# Altium project 113b_Buck_MN.PrjPcb
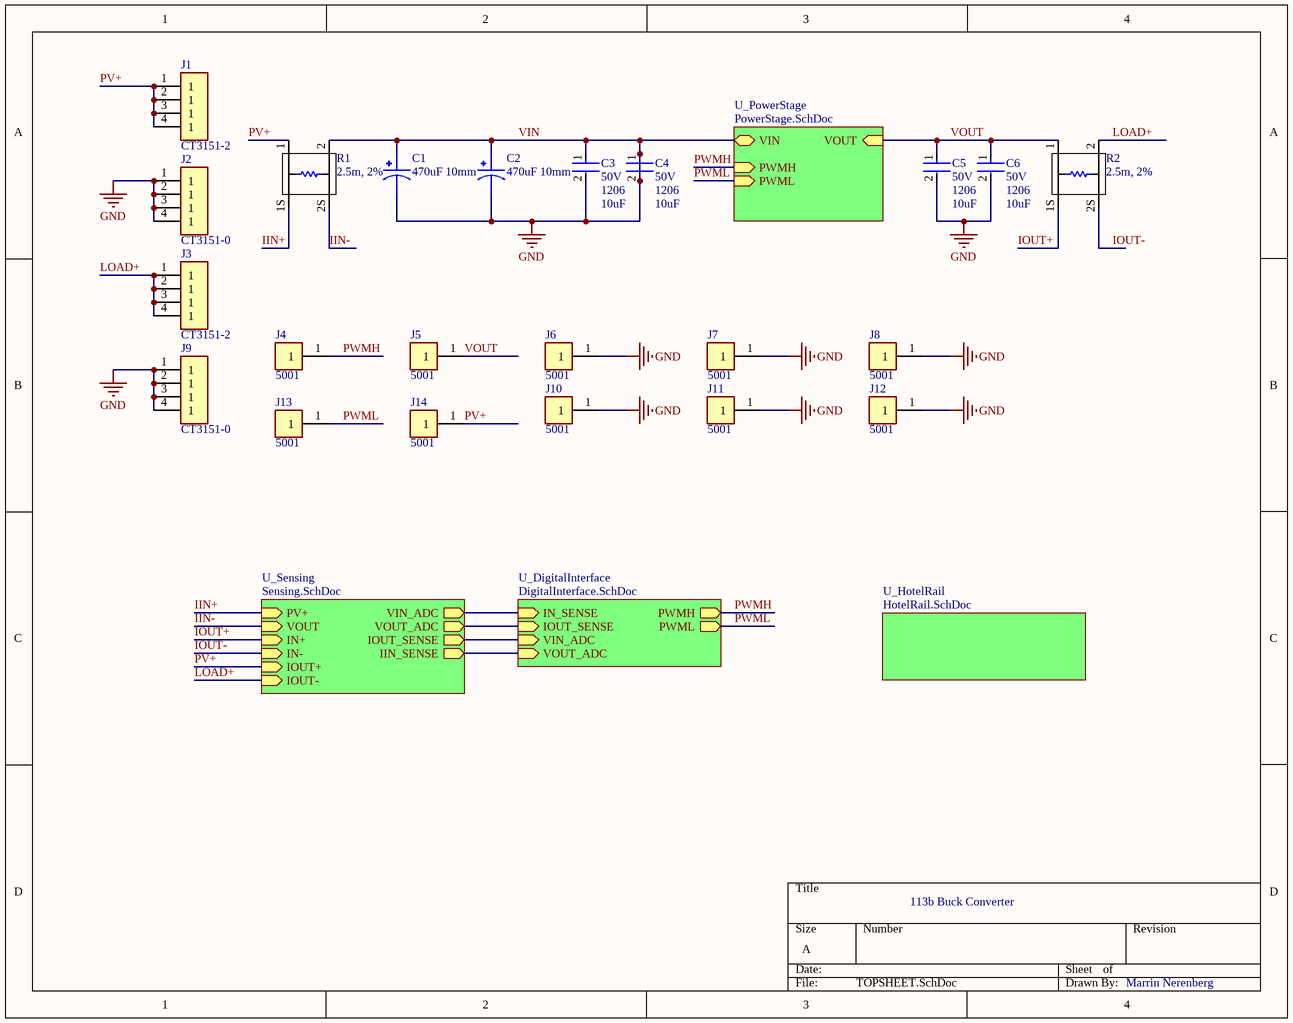
[diagram p0: TOPSHEET.SchDoc]
5 sheets, 95 parts. Net scope: hierarchical (ports join the sheet entries above them; power ports are global).
Board file: MN_BUCK113b_PCB.PcbDoc
Sheets:
  TOPSHEET.SchDoc
    U_HotelRail = HotelRail.SchDoc
    U_DigitalInterface = DigitalInterface.SchDoc
    U_Sensing = Sensing.SchDoc
    U_PowerStage = PowerStage.SchDoc

## Sheet TOPSHEET.SchDoc
size A; SheetNumber: 1; SheetTotal: 5

### Parts
C1  470uF 10mm  [CAPPRD500W60D1000H2200]
C2  470uF 10mm  [CAPPRD500W60D1000H2200]
C3  Voltage Rating (DC): 50V  Case/Package: 1206  Capacitance: 10uF  [FP-1206-L_3_2_0_2-W_1_6_0-IPC_B]  (hidden comment: 12065C475KAT2A)
C4  Voltage Rating (DC): 50V  Case/Package: 1206  Capacitance: 10uF  [FP-1206-L_3_2_0_2-W_1_6_0-IPC_B]  (hidden comment: 12065C475KAT2A)
C5  Voltage Rating (DC): 50V  Case/Package: 1206  Capacitance: 10uF  [FP-1206-L_3_2_0_2-W_1_6_0-IPC_B]  (hidden comment: 12065C475KAT2A)
C6  Voltage Rating (DC): 50V  Case/Package: 1206  Capacitance: 10uF  [FP-1206-L_3_2_0_2-W_1_6_0-IPC_B]  (hidden comment: 12065C475KAT2A)
J1  CT3151-2  [CALTEST_CT3151-2]
J2  CT3151-0  [CT3151-0]
J3  CT3151-2  [CALTEST_CT3151-2]
J4  5001  [FP-5001-MFG]
J5  5001  [FP-5001-MFG]
J6  5001  [FP-5001-MFG]
J7  5001  [FP-5001-MFG]
J8  5001  [FP-5001-MFG]
J9  CT3151-0  [CT3151-0]
J10  5001  [FP-5001-MFG]
J11  5001  [FP-5001-MFG]
J12  5001  [FP-5001-MFG]
J13  5001  [FP-5001-MFG]
J14  5001  [FP-5001-MFG]
R1  2.5m, 2%  [OHMITE_FC4L32]
R2  2.5m, 2%  [OHMITE_FC4L32]

### Sub-sheets
U_DigitalInterface = DigitalInterface.SchDoc: IN_SENSE (in), IOUT_SENSE (in), VIN_ADC (in), VOUT_ADC (in), PWMH (out), PWML (out)
U_HotelRail = HotelRail.SchDoc: no entries
U_PowerStage = PowerStage.SchDoc: VIN (bidir), PWMH (in), PWML (in), VOUT (in)
U_Sensing = Sensing.SchDoc: VIN_ADC (out), PV+ (in), VOUT (in), VOUT_ADC (out), IOUT_SENSE (out), IIN_SENSE (out), IN+ (in), IN- (in), IOUT+ (in), IOUT- (in)

### Nets
VIN: C1.1 C1.2 C2.1 C2.2 C3.1 C3.2 C4.1 C4.2 C5.2 C6.2 J2.1 J2.2(1) J2.3(1) J2.4(1) J6.1 J7.1 J8.1 J9.1 J9.2(1) J9.3(1) J9.4(1) J10.1 J11.1 J12.1 R1.2 ; sheet U_PowerStage/VIN  [also labelled GND]
IIN+: R1.1S ; sheet U_Sensing/PV+
IIN-: R1.2S ; sheet U_Sensing/VOUT
IN_SENSE: sheet U_DigitalInterface/IOUT_SENSE, sheet U_Sensing/VOUT_ADC
IOUT+: R2.1S ; sheet U_Sensing/IN+  [project net IN+]
IOUT-: R2.2S ; sheet U_Sensing/IN-  [project net IN-]
IOUT_SENSE: sheet U_DigitalInterface/IN_SENSE, sheet U_Sensing/VIN_ADC
LOAD+: J3.1 J3.2(1) J3.3(1) J3.4(1) R2.2 ; sheet U_Sensing/IOUT-  [project net IOUT-]
PV+: J1.1 J1.2(1) J1.3(1) J1.4(1) J14.1 R1.1 ; sheet U_Sensing/IOUT+  [project net IOUT+]
PWMH: J4.1 ; sheet U_DigitalInterface/PWMH, sheet U_PowerStage/PWMH
PWML: J13.1 ; sheet U_DigitalInterface/PWML, sheet U_PowerStage/PWML
VIN_ADC: sheet U_DigitalInterface/VIN_ADC, sheet U_Sensing/IOUT_SENSE
VOUT: C5.1 C6.1 J5.1 R2.1 ; sheet U_PowerStage/VOUT
VOUT_ADC: sheet U_DigitalInterface/VOUT_ADC, sheet U_Sensing/IIN_SENSE

### Notes on the sheet
- 113b Buck Converter
- Marrin Nerenberg

### Library data of the parts
C1 C2 = B41856C7477M000: MF: {'manufacturer': u'EPCOS'}; Package: None; Price: None; Value: *; MP: B41856C7477M000; Availability: Unavailable
C3-C6 = CMP-2000-07581-3: CAP CER 4.7UF 50V X7R 1206; Manufacturer: Kyocera AVX; Dissipation Factor: 2.5%; Tolerance: 10%; Mount: Surface Mount; Width: 1.6mm; Voltage Rating: 50V; Case Code (Imperial): 1206; Packaging: Tape and Reel; Min Operating Temperature: -55°C; Contact Plating: Tin; Radiation Hardening: No; Depth: 1.6mm; Series: -; Construction: Flat; Dielectric: X7R; Length: 3.2mm; Max Operating Temperature: 125°C; RoHS Compliant: Yes; Lead Free: Lead Free; Package Quantity: 1; Case Code (Metric): 3216; Termination: SMD/SMT; REACH SVHC: No SVHC; Thickness: 0.07inch; Manufacturer Part Number: 12065C475KAT2A
J1 J3 = CT3151-2_1: Banana Jack Connector Standard Banana Solder Red; MF: {'manufacturer': u'Cal Test'}; Package: None; Price: None; Value: *; MP: CT3151-2; Availability: Unavailable
J2 J9 = CT3151-2: Banana Jack Connector Standard Banana Solder Red; MF: {'manufacturer': u'Cal Test'}; Package: None; Price: None; Value: *; MP: CT3151-2; Availability: Unavailable
J4-J8 J10-J14 = CMP-2000-05181-2: PC TEST POINT MINIATURE BLACK; Manufacturer: Keystone Electronics; Body Material: Bronze; Plating: Silver; Inside Diameter: 1.27mm; Hole Diameter: 1.6mm; Number of Ports: 1; Outside Diameter: 2.54mm; Insulation: Insulated; Insulation Material: Nylon; Mount: Through Hole; RoHS Compliant: Yes; Series: THM; Height: 0.3inch; Termination: Through Hole; Material: Nylon; Packaging: Bulk; Contact Material: Bronze; REACH SVHC: No SVHC; Contact Plating: Silver; Orientation: Straight; Lead Free: Lead Free; Package Quantity: 100; Length: 7.62mm; Flammability Rating: UL94 V-0; Number of Contacts: 1; Diameter: 2.54mm; Housing Color: Black; Color: Black; Manufacturer Part Number: 5001
R1 R2 = FC4L32R002GER: 2m, 0612, 2%, 1W; ID: 79; Mfg: Ohmite; Voltage: 0.045V; Current: 45A; TempOperatingMax: 155; TempOperatingMin: -55; MfgPN: FC4L32R002GER; Value: 2.5m; Tolerance: 2%; Power: 1W; RoHS: True; SMD: True; Material: Metal Foil; Footprint: 0612; Supplier 1: Digi-Key; Supplier Part Number 1: FC4L32R002GER-ND

## Sheet HotelRail.SchDoc
size A; SheetNumber: 5; SheetTotal: 5
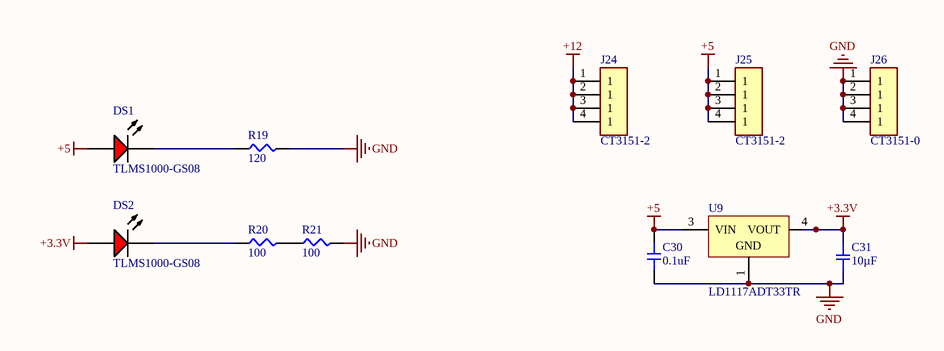
[diagram p1: HotelRail.SchDoc]

### Parts
C30  0.1uF
C31  10µF  [SMD-0603-RES]
DS1  TLMS1000-GS08  [VISH-TLMS1000_V]
DS2  TLMS1000-GS08  [VISH-TLMS1000_V]
J24  CT3151-2  [CALTEST_CT3151-2]
J25  CT3151-2  [CALTEST_CT3151-2]
J26  CT3151-0  [CT3151-0]
R19  120  [SMD-0603-RES]
R20  100  [SMD-0603-RES]
R21  100  [SMD-0603-RES]
U9  LD1117ADT33TR  [TO-252_L]

### Nets
+3.3V: C31.1 DS2.1(A) U9.4(VOUT)
+5: C30.2 DS1.1(A) J25.1 J25.2(1) J25.3(1) J25.4(1) U9.3(VIN)
+12: J24.1 J24.2(1) J24.3(1) J24.4(1)
GND: C30.1 C31.2 J26.1 J26.2(1) J26.3(1) J26.4(1) R19.2 R21.2 U9.1(GND)  [project net VIN]
NetDS1_2: DS1.2(K) R19.1
NetDS2_2: DS2.2(K) R20.1
NetR20_2: R20.2 R21.1

### Library data of the parts
C30 = C1608X7R1H104K080AA: 0.1uF, 0603, +/- 10%, 50V, X7R; Tolerance: +/- 10%; ID: 1; Mfg: TDK Corporation; TempOperatingMax: 125; TempOperatingMin: -55; TempStorageMax: 40; TempStorageMin: 5; Value: 0.1uF; MfgPN: C1608X7R1H104K080AA; Voltage: 50V; Material: X7R; RoHS: True; SMD: True; Footprint: 0603; Supplier 1: Digi-Key; Supplier Part Number 1: 445-1314-1-ND
C31 = GRM188R60J106ME47D: CAP CER 10UF 6.3V X5R 0603; Manufacturer: Murata Electronics North America; Factory Stock: 0; Unit Price (USD): 0.15; Minimum Quantity: 1; Tolerance: ±20%; Part Number: GRM188R60J106ME47D; Datasheets: http://www.murata.com/~/media/webrenewal/support/library/catalog/products/capacitor/mlcc/c02e.pdf; Image: //media.digikey.com/Renders/Murata%20Renders/ZRB-SERIES-0402.jpg; Digi-Key Part Number: 490-3896-1-ND; Quantity Available: 1578882; @ qty: 0; Packaging: Cut Tape (CT); Series: GRM; Part Status: Active; Value: 10µF; Voltage: 6.3V; Temperature Coefficient: X5R; Operating Temperature: -55°C ~ 85°C; Features: -; Ratings: -; Applications: General Purpose; Mounting Type: Surface Mount, MLCC; Package / Case: 0603 (1608 Metric); Size / Dimension: 0.063" L x 0.031" W (1.60mm x 0.80mm); Height - Seated (Max): -; Thickness (Max): 0.035" (0.90mm); Lead Spacing: -; Lead Style: -
DS1 DS2 = CMP-2000-07254-1: Low Current LED, 40 mW, 1.8 V, -40 to 100 degC, 2-Pin SMD (0603), RoHS, Tape and Reel; Manufacturer: Vishay; Lens Shape: Rectangular; Automotive Qualification Standard: AEC-Q100; Wavelength Typ: 636nm; SVHC: ToBeAdvised; LED Colour: Red; Bulb Size: 1.6mmx0.8mm; Forward Voltage: 1.8V; Luminous Intensity: 4mcd; Forward Current If: 2mA; Viewing Angle: 80°; Datasheet Version: Rev. 1.7, 02/2011; Datasheet URL: https://datasheet.ciiva.com/5798/1698881-5798337.pdf; LED Mounting: SMD; Packaging: CutTape; Package Reference: TLMS1000; Manufacturer URL: http://www.vishay.com/; Mounting Technology: SurfaceMount; Product Range: -; Package Description: 2-Pin Surface Mount Device, Body 1.6 x 0.8 mm; MSL: MSL2-1year; Manufacturer Part Number: TLMS1000-GS08
J24 J25 = CT3151-2_1: as J1 on sheet TOPSHEET; Package: None; Price: None; Value: *; MP: CT3151-2; Availability: Unavailable
J26 = CT3151-2: as J2 on sheet TOPSHEET; Package: None; Price: None; Value: *; MP: CT3151-2; Availability: Unavailable
R19 = ERJ-3EKF1200V: RES SMD 120 OHM 1% 1/10W 0603; Manufacturer: Panasonic Electronic Components; Factory Stock: 0; Unit Price (USD): 0.00379; @ qty: 1500; Minimum Quantity: 1; Power (Watts): 0.1W, 1/10W; Temperature Coefficient: ±100ppm/°C; Part Number: ERJ-3EKF1200V; Datasheets: http://industrial.panasonic.com/www-cgi/jvcr13pz.cgi?E+PZ+3+AOA0002+ERJ3EKF1200V+7+WW; Image: //media.digikey.com/Photos/Panasonic%20Photos/MFG_ERJ-P6W%20Series.jpg; Digi-Key Part Number: P120HCT-ND; Quantity Available: 84623; Packaging: Cut Tape (CT); Series: ERJ; Part Status: Active; Value: 120; Tolerance: ±1%; Composition: Thick Film; Features: Automotive AEC-Q200; Operating Temperature: -55°C ~ 155°C; Package / Case: 0603 (1608 Metric); Supplier Device Package: 0603; Size / Dimension: 0.063" L x 0.031" W (1.60mm x 0.80mm); Height - Seated (Max): 0.022" (0.55mm); Number of Terminations: 2; Failure Rate: -
R20 R21 = ERJ-3EKF1000V: RES SMD 100 OHM 1% 1/10W 0603; Manufacturer: Panasonic Electronic Components; Factory Stock: 0; Unit Price (USD): 0.00379; @ qty: 1500; Minimum Quantity: 1; Power (Watts): 0.1W, 1/10W; Temperature Coefficient: ±100ppm/°C; Part Number: ERJ-3EKF1000V; Datasheets: http://industrial.panasonic.com/www-cgi/jvcr13pz.cgi?E+PZ+3+AOA0002+ERJ3EKF1000V+7+WW; Image: //media.digikey.com/Photos/Panasonic%20Photos/MFG_ERJ-P6W%20Series.jpg; Digi-Key Part Number: P100HCT-ND; Quantity Available: 1544120; Packaging: Cut Tape (CT); Series: ERJ; Part Status: Active; Value: 100; Tolerance: ±1%; Composition: Thick Film; Features: Automotive AEC-Q200; Operating Temperature: -55°C ~ 155°C; Package / Case: 0603 (1608 Metric); Supplier Device Package: 0603; Size / Dimension: 0.063" L x 0.031" W (1.60mm x 0.80mm); Height - Seated (Max): 0.022" (0.55mm); Number of Terminations: 2; Failure Rate: -
U9 = CMP-0244-00137-1: 1A, Low Drop Positive Voltage Regulator, 3.3V, 3-Pin DPAK, Tape and Reel; Manufacturer: STMicroelectronics; ComponentLink2URL: http://www.st.com/internet/com/TECHNICAL_RESOURCES/TECHNICAL_LITERATURE/DATASHEET/CD00002116.pdf; ComponentLink2Description: Datasheet; ComponentLink1URL: http://www.st.com; PackageDescription: 3-Pin Transistor Outline Package 2.28 mm Pitch, 9.7 mm Lead Span (DPAK); ComponentLink1Description: Manufacturer URL; PackageVersion: 2011; PackageReference: TO-252; DatasheetVersion: 2/12/2011; Manufacturer Part Number: LD1117ADT33TR

## Sheet DigitalInterface.SchDoc
size A; SheetNumber: 4; SheetTotal: 5
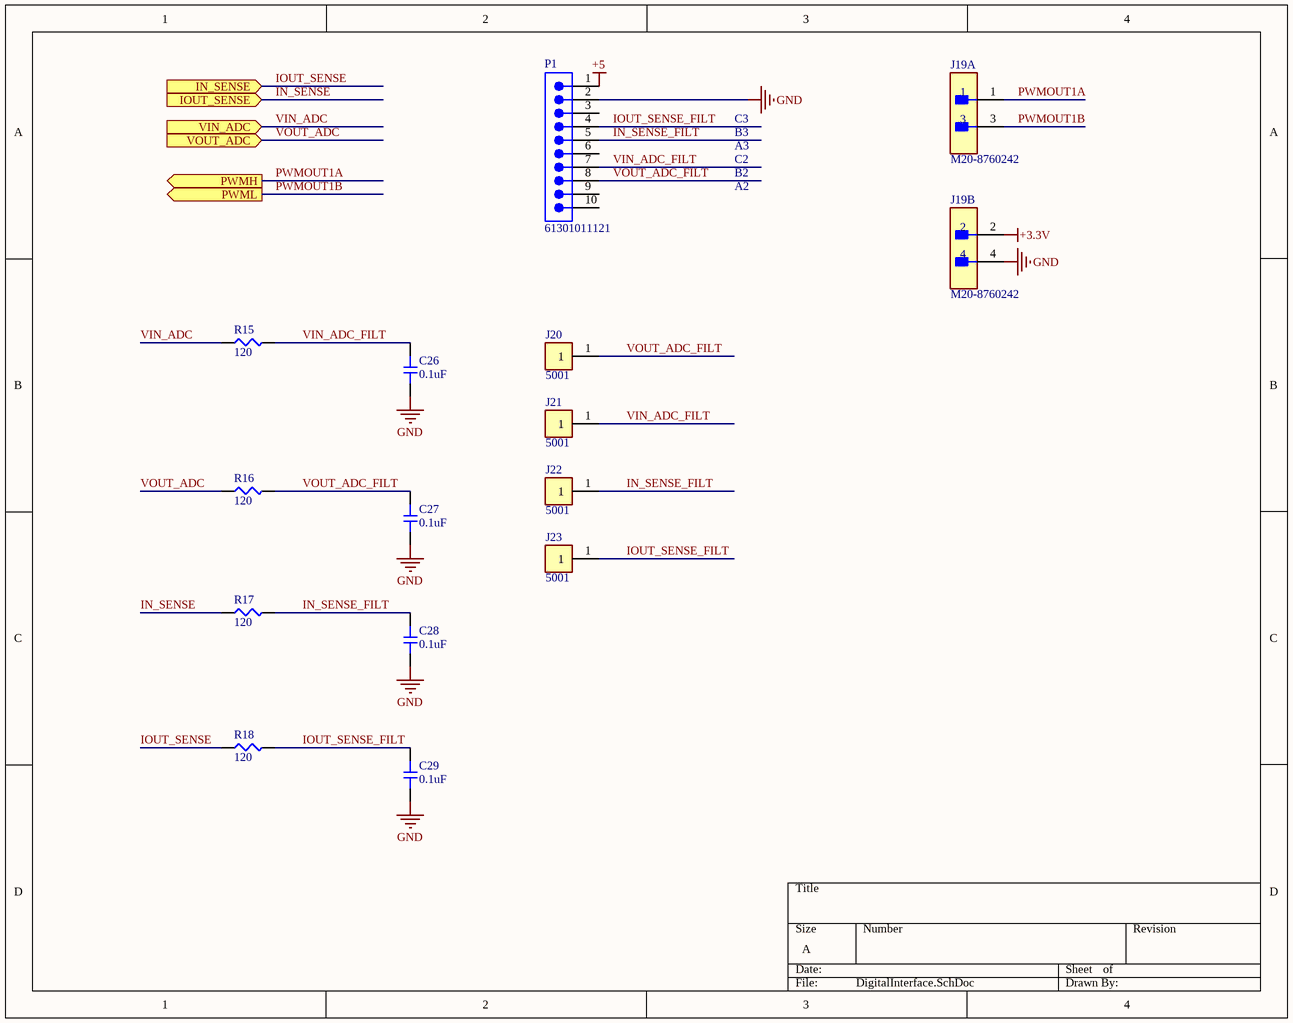
[diagram p2: DigitalInterface.SchDoc]

### Parts
C26  0.1uF
C27  0.1uF
C28  0.1uF
C29  0.1uF
J19  M20-8760242  [FP-M20-8760242-MFG]  (parts A,B of 2)
J20  5001  [FP-5001-MFG]
J21  5001  [FP-5001-MFG]
J22  5001  [FP-5001-MFG]
J23  5001  [FP-5001-MFG]
P1  61301011121  [61301011121]
R15  120  [SMD-0603-RES]
R16  120  [SMD-0603-RES]
R17  120  [SMD-0603-RES]
R18  120  [SMD-0603-RES]

### Ports
IN_SENSE (in), IOUT_SENSE (in), PWMH (out), PWML (out), VIN_ADC (in), VOUT_ADC (in)

### Nets
+3.3V: J19.2
+5: P1.1
GND: C26.1 C27.1 C28.1 C29.1 J19.4 P1.2  [project net VIN]
IN_SENSE: R17.1 ; port IOUT_SENSE
IN_SENSE_FILT: C28.2 J22.1 P1.5 R17.2
IOUT_SENSE: R18.1 ; port IN_SENSE
IOUT_SENSE_FILT: C29.2 J23.1 P1.4 R18.2
PWMOUT1A: J19.1 ; port PWMH  [project net PWMH]
PWMOUT1B: J19.3 ; port PWML  [project net PWML]
VIN_ADC: R15.1 ; port VIN_ADC
VIN_ADC_FILT: C26.2 J21.1 P1.7 R15.2
VOUT_ADC: R16.1 ; port VOUT_ADC
VOUT_ADC_FILT: C27.2 J20.1 P1.8 R16.2

Not connected (* = marked no-connect by the designer): P1 3 6 9 10

### Notes on the sheet
- C3
- B3
- A3
- C2
- B2
- A2

### Library data of the parts
C26-C29 = C1608X7R1H104K080AA: as C30 on sheet HotelRail; Value: 0.1uF; MfgPN: C1608X7R1H104K080AA; Voltage: 50V; Material: X7R; RoHS: True; SMD: True; Footprint: 0603; Supplier 1: Digi-Key; Supplier Part Number 1: 445-1314-1-ND
J19 = CMP-15831-000048-1: CONN HEADER SMD 4POS 2.54MM; Manufacturer: Harwin; Contact Resistance: 25mR; Max Current Rating: 3A; Row Spacing: 0.1inch; Gender: Male; Number of Contacts: 4; Connector Type: Male Pin; Contact Mating Length: 0.228inch; Max Operating Temperature: 105°C; Depth: 5.08mm; Contact Material: Bronze; Packaging: Bulk; Series: M20; Radiation Hardening: No; Length: 5.08mm; Contact Type: Male Pin; Housing Material: Nylon; Pitch: 2.54mm; Color: Black; RoHS Compliant: Yes; Package Quantity: 1000; Orientation: Straight; Housing Color: Black; Min Operating Temperature: -40°C; Termination: Solder; Contact Plating: Gold; Mount: Surface Mount; Number of Rows: 2; Number of Positions: 4; Manufacturer Part Number: M20-8760242
J20-J23 = CMP-2000-05181-2: as J4 on sheet TOPSHEET; Insulation Material: Nylon; Mount: Through Hole; RoHS Compliant: Yes; Series: THM; Height: 0.3inch; Termination: Through Hole; Material: Nylon; Packaging: Bulk; Contact Material: Bronze; REACH SVHC: No SVHC; Contact Plating: Silver; Orientation: Straight; Lead Free: Lead Free; Package Quantity: 100; Length: 7.62mm; Flammability Rating: UL94 V-0; Number of Contacts: 1; Diameter: 2.54mm; Housing Color: Black; Color: Black; Manufacturer Part Number: 5001
P1 = CMP-1502-01082-4: NexarPartId: 18818159; Manufacturer: Wurth Electronics; Operating Supply Voltage: 250V; Insulation Resistance: 1GΩ; Contact Resistance: 20mΩ; Current Rating: 3A; Connector Type: Male Pin; Gender: Male; Number of Contacts: 10; Pitch: 2.54mm; REACH SVHC: Unknown; Min Operating Temperature: -40°C; Max Operating Temperature: 105°C; Height: 8.74mm; Packaging: Bulk; Orientation: Vertical; Number of Pins: 10; Contact Mating Length: 5.9944mm; Voltage Rating: 250V; Number of Positions: 10; Termination: Solder; Number of Rows: 1; Contact Material: Copper; Housing Material: PBT; Mount: Through Hole; Lead Pitch: 2.54mm; Contact Plating: Gold; Contact Gender: Male; Color: Black; Flammability Rating: UL94 V-0; RoHS: Compliant; Width: 25.4mm; Length: 2.54mm; Manufacturer Part Number: 61301011121
R15-R18 = ERJ-3EKF1200V: as R19 on sheet HotelRail; Part Number: ERJ-3EKF1200V; Datasheets: http://industrial.panasonic.com/www-cgi/jvcr13pz.cgi?E+PZ+3+AOA0002+ERJ3EKF1200V+7+WW; Image: //media.digikey.com/Photos/Panasonic%20Photos/MFG_ERJ-P6W%20Series.jpg; Digi-Key Part Number: P120HCT-ND; Quantity Available: 84623; Packaging: Cut Tape (CT); Series: ERJ; Part Status: Active; Value: 120; Tolerance: ±1%; Composition: Thick Film; Features: Automotive AEC-Q200; Operating Temperature: -55°C ~ 155°C; Package / Case: 0603 (1608 Metric); Supplier Device Package: 0603; Size / Dimension: 0.063" L x 0.031" W (1.60mm x 0.80mm); Height - Seated (Max): 0.022" (0.55mm); Number of Terminations: 2; Failure Rate: -

## Sheet Sensing.SchDoc
size A; SheetNumber: 3; SheetTotal: 5
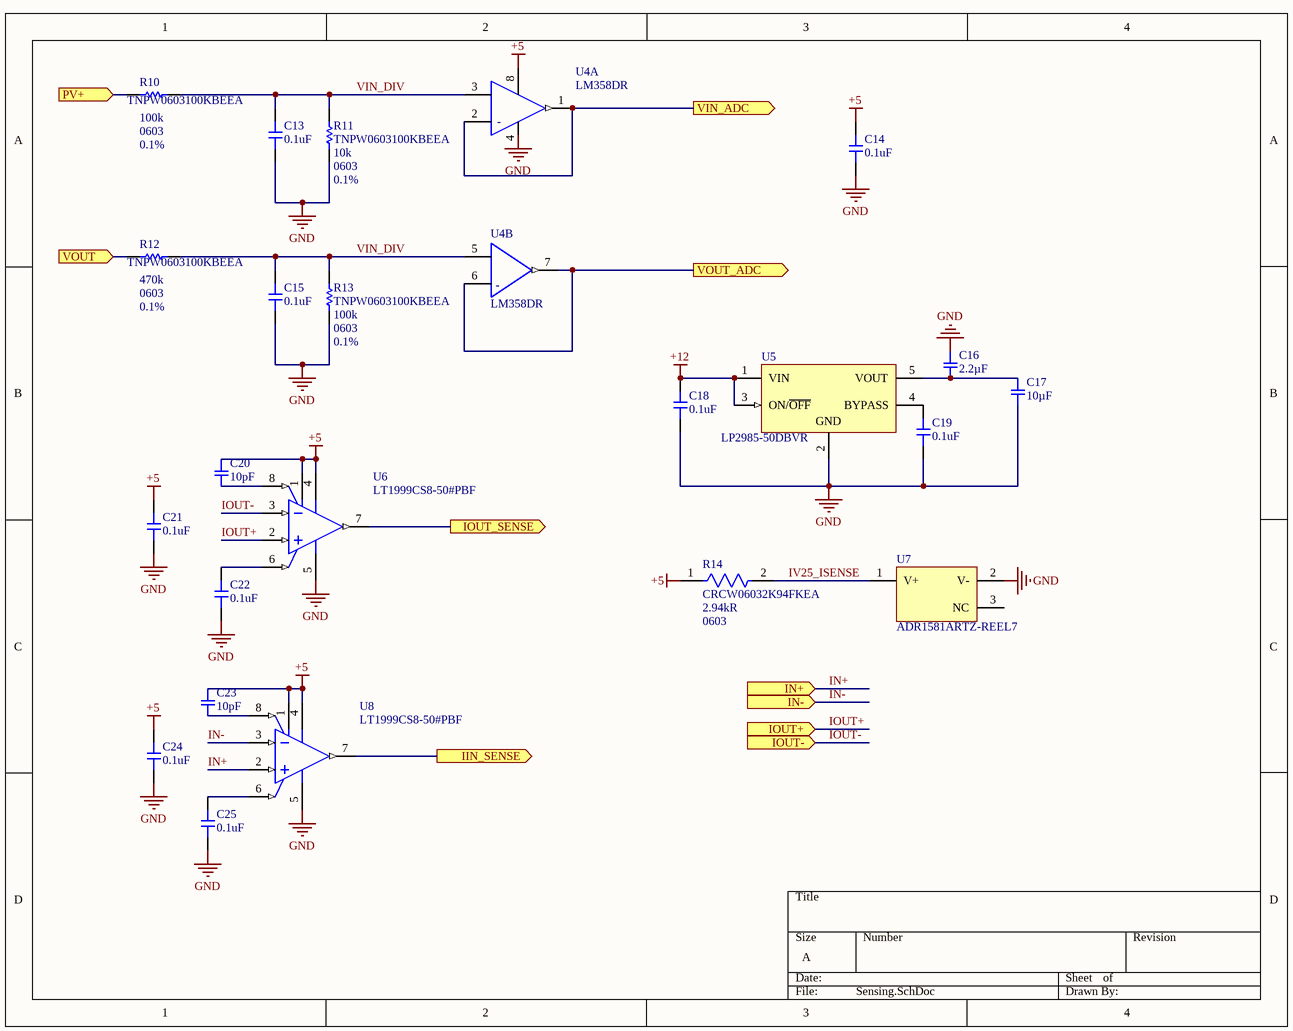
[diagram p3: Sensing.SchDoc]

### Parts
C13  0.1uF
C14  0.1uF
C15  0.1uF
C16  2.2µF  [SMD-0603-RES]
C17  10µF  [SMD-0603-RES]
C18  0.1uF
C19  0.1uF
C20  10pF  [SMD-0603-RES]
C21  0.1uF
C22  0.1uF
C23  10pF  [SMD-0603-RES]
C24  0.1uF
C25  0.1uF
R10  TNPW0603100KBEEA  Reistance: 100k  Size: 0603  Tolerance: 0.1%  [RESC1609X55X30ML10T20]
R11  TNPW0603100KBEEA  Reistance: 10k  Size: 0603  Tolerance: 0.1%  [RESC1609X55X30ML10T20]
R12  TNPW0603100KBEEA  Reistance: 470k  Size: 0603  Tolerance: 0.1%  [RESC1609X55X30ML10T20]
R13  TNPW0603100KBEEA  Reistance: 100k  Size: 0603  Tolerance: 0.1%  [RESC1609X55X30ML10T20]
R14  CRCW06032K94FKEA  Resistance: 2.94kR  Case/Package: 0603  [FP-CRCW0603-e3-IPC_B]
U4  LM358DR  [FP-D0008A-MFG]  (parts A,B of 2)
U5  LP2985-50DBVR  [DBV0005A_M]
U6  LT1999CS8-50#PBF  [LT-S8-8_L]
U7  ADR1581ARTZ-REEL7  [ADI-RT-3_N]
U8  LT1999CS8-50#PBF  [LT-S8-8_L]

### Ports
IIN_SENSE (out), IN+ (in), IN- (in), IOUT+ (in), IOUT- (in), IOUT_SENSE (out), PV+ (in), VIN_ADC (out), VOUT (in), VOUT_ADC (out)

### Nets
+5: C14.2 C20.1 C21.2 C23.1 C24.2 R14.1 U4.8(V+) U6.1(V+) U6.4(V+) U8.1(V+) U8.4(V+)
+12: C18.1 U5.1(VIN) U5.3(ON/~{OFF})
GND: C13.1 C14.1 C15.1 C16.1 C17.2 C18.2 C19.1 C21.1 C22.1 C24.1 C25.1 R11.1 R13.1 U5.2(GND) U6.5(GND) U7.2(V-) U8.5(GND)  [project net VIN]
IIN+: R10.1 ; port PV+
IIN-: R12.1 ; port VOUT
IN+: U8.2(+IN) ; port IN+
IN-: U8.3(-IN) ; port IN-
IN_SENSE: U4.6(IN2-) U4.7(2OUT) ; port VOUT_ADC
IOUT+: U6.2(+IN) ; port IOUT+
IOUT-: U6.3(-IN) ; port IOUT-
IOUT_SENSE: U4.1(1OUT) U4.2(IN1-) ; port VIN_ADC
IV25_ISENSE: R14.2 U7.1(V+)
VIN_ADC: U6.7(OUT) ; port IOUT_SENSE
VIN_DIV: C13.2 C15.2 R10.2 R11.2 R12.2 R13.2 U4.3(IN1+) U4.5(IN2+)
VOUT_ADC: U8.7(OUT) ; port IIN_SENSE
NetC16_2: C16.2 C17.1 U5.5(VOUT)
NetC19_2: C19.2 U5.4(BYPASS)
NetC20_2: C20.2 U6.8(~{SHDN})
NetC22_2: C22.2 U6.6(REF)
NetC23_2: C23.2 U8.8(~{SHDN})
NetC25_2: C25.2 U8.6(REF)

Not connected (* = marked no-connect by the designer): U4 4(V-); U7 3(NC)

### Notes on the sheet
- Labels drawn without touching a wire or pin: GND
- (in symbol CMP-1685-00009-2, part A) -
- (in symbol CMP-1685-00009-2, part B) -

### Library data of the parts
C13-C15 C18 C19 C21 C22 C24 C25 = C1608X7R1H104K080AA: as C30 on sheet HotelRail; Value: 0.1uF; MfgPN: C1608X7R1H104K080AA; Voltage: 50V; Material: X7R; RoHS: True; SMD: True; Footprint: 0603; Supplier 1: Digi-Key; Supplier Part Number 1: 445-1314-1-ND
C16 = GRM188R61C225KE15D: CAP CER 2.2UF 16V X5R 0603; Manufacturer: Murata Electronics North America; Factory Stock: 0; Unit Price (USD): 0.12; Minimum Quantity: 1; Tolerance: ±10%; Part Number: GRM188R61C225KE15D; Datasheets: http://www.murata.com/~/media/webrenewal/support/library/catalog/products/capacitor/mlcc/c02e.pdf; Image: //media.digikey.com/Renders/Murata%20Renders/ZRB-SERIES-0402.jpg; Digi-Key Part Number: 490-3296-1-ND; Quantity Available: 1668676; @ qty: 0; Packaging: Cut Tape (CT); Series: GRM; Part Status: Active; Value: 2.2µF; Voltage: 16V; Temperature Coefficient: X5R; Operating Temperature: -55°C ~ 85°C; Features: -; Ratings: -; Applications: General Purpose; Mounting Type: Surface Mount, MLCC; Package / Case: 0603 (1608 Metric); Size / Dimension: 0.063" L x 0.031" W (1.60mm x 0.80mm); Height - Seated (Max): -; Thickness (Max): 0.035" (0.90mm); Lead Spacing: -; Lead Style: -
C17 = GRM188R61A106KE69D: CAP CER 10UF 10V X5R 0603; Manufacturer: Murata Electronics North America; Factory Stock: 0; Unit Price (USD): 0.18; Minimum Quantity: 1; Tolerance: ±10%; Part Number: GRM188R61A106KE69D; Datasheets: http://www.murata.com/~/media/webrenewal/support/library/catalog/products/capacitor/mlcc/c02e.pdf; Image: //media.digikey.com/Renders/Murata%20Renders/ZRB-SERIES-0402.jpg; Digi-Key Part Number: 490-10474-1-ND; Quantity Available: 59221; @ qty: 0; Packaging: Cut Tape (CT); Series: GRM; Part Status: Active; Value: 10µF; Voltage: 10V; Temperature Coefficient: X5R; Operating Temperature: -55°C ~ 85°C; Features: Derating Recommended; Ratings: -; Applications: General Purpose; Mounting Type: Surface Mount, MLCC; Package / Case: 0603 (1608 Metric); Size / Dimension: 0.063" L x 0.031" W (1.60mm x 0.80mm); Height - Seated (Max): -; Thickness (Max): 0.037" (0.95mm); Lead Spacing: -; Lead Style: -
C20 C23 = GQM1885C1H100JB01D: CAP CER 10PF 50V NP0 0603; Manufacturer: Murata Electronics North America; Factory Stock: 0; Unit Price (USD): 0.6; Minimum Quantity: 1; Tolerance: ±5%; Temperature Coefficient: C0G, NP0; Part Number: GQM1885C1H100JB01D; Datasheets: http://www.murata.com/~/media/webrenewal/support/library/catalog/products/capacitor/mlcc/c02e.pdf; Image: //media.digikey.com/Renders/Murata%20Renders/0603%28LQG18%29.jpg; Digi-Key Part Number: 490-3570-1-ND; Quantity Available: 26659; @ qty: 0; Packaging: Cut Tape (CT); Series: GQM; Part Status: Active; Value: 10pF; Voltage: 50V; Operating Temperature: -55°C ~ 125°C; Features: High Q, Low Loss; Ratings: -; Applications: RF, Microwave, High Frequency; Mounting Type: Surface Mount, MLCC; Package / Case: 0603 (1608 Metric); Size / Dimension: 0.063" L x 0.031" W (1.60mm x 0.80mm); Height - Seated (Max): -; Thickness (Max): 0.035" (0.90mm); Lead Spacing: -; Lead Style: -
R10-R13 = CMP-2000-03685-1: Manufacturer: Vishay Dale; Part Number: TNPW0603100KBEEA; Manufacturer Part Number: TNPW0603100KBEEA
R14 = CMP-2000-03188-2: RES Thick Film, 2.94kΩ, 1%, 0.1W, 100ppm/°C, 0603; Manufacturer: Vishay; Max Power Dissipation: 100mW; Voltage Rating: 75V; Military Standard: Not; Composition: Thick Film; Number of Terminations: 2; Case Code (Metric): 1608; Max Operating Temperature: 155°C; Contact Plating: Tin; Package Quantity: 10; Power Rating: 100mW; Termination: SMD/SMT; Length: 1.55mm; Min Operating Temperature: -55°C; Radiation Hardening: No; Packaging: Tape and Reel; Tolerance: 1%; Temperature Coefficient: 100ppm/°C; Case Code (Imperial): 0603; Height: 0.45mm; Number of Pins: 2; Depth: 0.85mm; Width: 0.85mm; Weight: 7.1E-05oz; Features: Automotive AEC-Q200; Manufacturer Part Number: CRCW06032K94FKEA
U4 = CMP-1685-00009-2: IC OPAMP GP 2 CIRCUIT 8SOIC; Manufacturer: Texas Instruments; Output Current: 30mA; Min Dual Supply Voltage: 1.5V; Input Offset Voltage (Vos): 7mV; Power Supply Rejection Ratio (PSRR): 65dB; Unity Gain Bandwidth Product: 700kHz; Number of Channels: 2; Min Supply Voltage: 3V; Max Dual Supply Voltage: 16V; Dual Supply Voltage: 9V; Max Supply Voltage: 32V; Nominal Supply Current: 1.2mA; Slew Rate: 0.3V/µs; Input Bias Current: 250nA; Voltage Gain: 100dB; Operating Supply Current: 1mA; REACH SVHC: No SVHC; Package Quantity: 2500; Width: 3.91mm; Max Operating Temperature: 70°C; Min Operating Temperature: 0°C; Mount: Surface Mount; Length: 4.9mm; Radiation Hardening: No; Case/Package: SOIC; Lead Free: Lead Free; Number of Elements: 2; Packaging: Tape and Reel; Output Current per Channel: 30mA; Number of Circuits: 2; Bandwidth: 700kHz; Operating Supply Voltage: 16V; Gain Bandwidth Product: 700kHz; Number of Pins: 8; Number of Amplifiers: 2; Height: 1.58mm; Common Mode Rejection Ratio: 65dB; Contact Plating: Gold; Manufacturer Part Number: LM358DR
U5 = CMP-0758-00084-2: Single Output Low Noise LDO, 150 mA, Fixed 5 V Output, 1.5% Tolerance, 2.2 to 16 V Input, Low IQ, 5-Pin SOT-23 (DBV), -40 to 125 degC, Green (RoHS & no Sb/Br), Tape and Reel; Manufacturer: Texas Instruments; Accuracy (%): 1.5; Iout (Max) (A): 0.15; Fixed Output Options (V): 5; Vdo (Typ) (mV): 280; Output Options: Fixed Output; Iq (Typ) (mA): 0.85; DatasheetVersion: SLVS522N; PackageDescription: 5-Pin Plastic Small Outline, Body 2.9 x 1.6 mm, Pitch 0.95 mm; RoHS: TRUE; ComponentLink3URL: http://www.ti.com/litv/pdf/mpds018j; PartNumber: LP2985-50DBVR; PackageReference: DBV0005A; ComponentLink2URL: http://www.ti.com/lit/ds/symlink/lp2985-50.pdf; Mounting Technology: Surface Mount; ComponentLink1Description: Manufacturer URL; Vin (V): 2.2 to 16; ComponentLink3Description: Package Specification; ComponentLink1URL: http://www.ti.com/; PackageVersion: 4073253-4/L; ComponentLink2Description: Datasheet; Packing: Tape and Reel; Operating Temperature Range (degC): -40 to 125; Manufacturer Part Number: LP2985-50DBVR
U6 U8 = CMP-0359-03365-2: Single Channel, High Voltage, Bidirectional Current Sense Amplifier, 2 MHz Typical GBW, 3 V/us Typical SR, 4.5 to 5.5 V, 8-Pin SOIC (S8-8), Commercial, Pb-Free; Manufacturer: Linear Technology; Linear Technology Part Number: LT1999-50; Manufacturer: Analog Devices / Linear Technology; Vos (mV) Typical: 0.5; SR (V/us) Typical: 3; Is (mA) Typical: 1.55; GBW (MHz) Typical: 2; Vs Min (V): 4.5; Vs Max (V): 5.5; Channels (#): 1; RoHS: Pb-Free; PackageDescription: 8-Pin Plastic Small Outline, Body 4.9 x 3.9 mm, Pitch 1.27 mm; ComponentLink3Description: Package Specification; PackageReference: LT-S8-8; PartNumber: LT1999CS8-50#PBF; DatasheetVersion: Rev. B; ComponentLink1URL: http://www.linear.com/; RevisionNote: URLs updated; Type: CSA; ComponentLink2URL: http://cds.linear.com/docs/en/datasheet/1999fb.pdf; Mounting Technology: Surface Mount; ComponentLink3URL: http://cds.linear.com/docs/en/packaging/05081610_G_SO8.pdf; ComponentLink1Description: Manufacturer URL; PackageVersion: Rev G; ComponentLink2Description: Datasheet; Manufacturer Part Number: LT1999CS8-50#PBF
U7 = CMP-0784-00432-1: Micropower, Precision Shunt Voltage Reference, 1.25 V Output, Industrial, 3-pin SOT23 (RT-3), Reel; Manufacturer: Analog Devices; Ref Out TC (ppm/C): 100; Vout: 1.25V; PackageDescription: 3-Pin Small Outline Transistor Package, Body 2.9 x 1.3 mm, Pitch 0.96 mm; ComponentLink4Description: URL Link1; ComponentLink3URL: http:/www.analog.com/static/imported-files/packages/PKG_PDF/SOT-23-3 (RT)/RT_3.pdf; ComponentLink2URL: http://www.analog.com/static/imported-files/data_sheets/ADR1581.pdf; ComponentLink1Description: Manufacturer URL; Code_JEDEC: TO-236-AB; PartNumber: ADR1581ARTZ-REEL7; ComponentLink2Description: Datasheet; DatasheetVersion: Rev. 0; PackageVersion: 011909-C, 02/2009; ComponentLink4URL: Product URL:http://www.analog.com/en/special-linear-functions/voltage-references/adr1581/products/product.html; Mounting Technology: Surface Mount; PackageReference: RT-3; Packing: Reel; ComponentLink1URL: http://www.analog.com/en/index.html; ComponentLink3Description: Package Specification; Operating Temp Range: -40 to 85 degC; Manufacturer Part Number: ADR1581ARTZ-REEL7

## Sheet PowerStage.SchDoc
size A; SheetNumber: 2; SheetTotal: 5
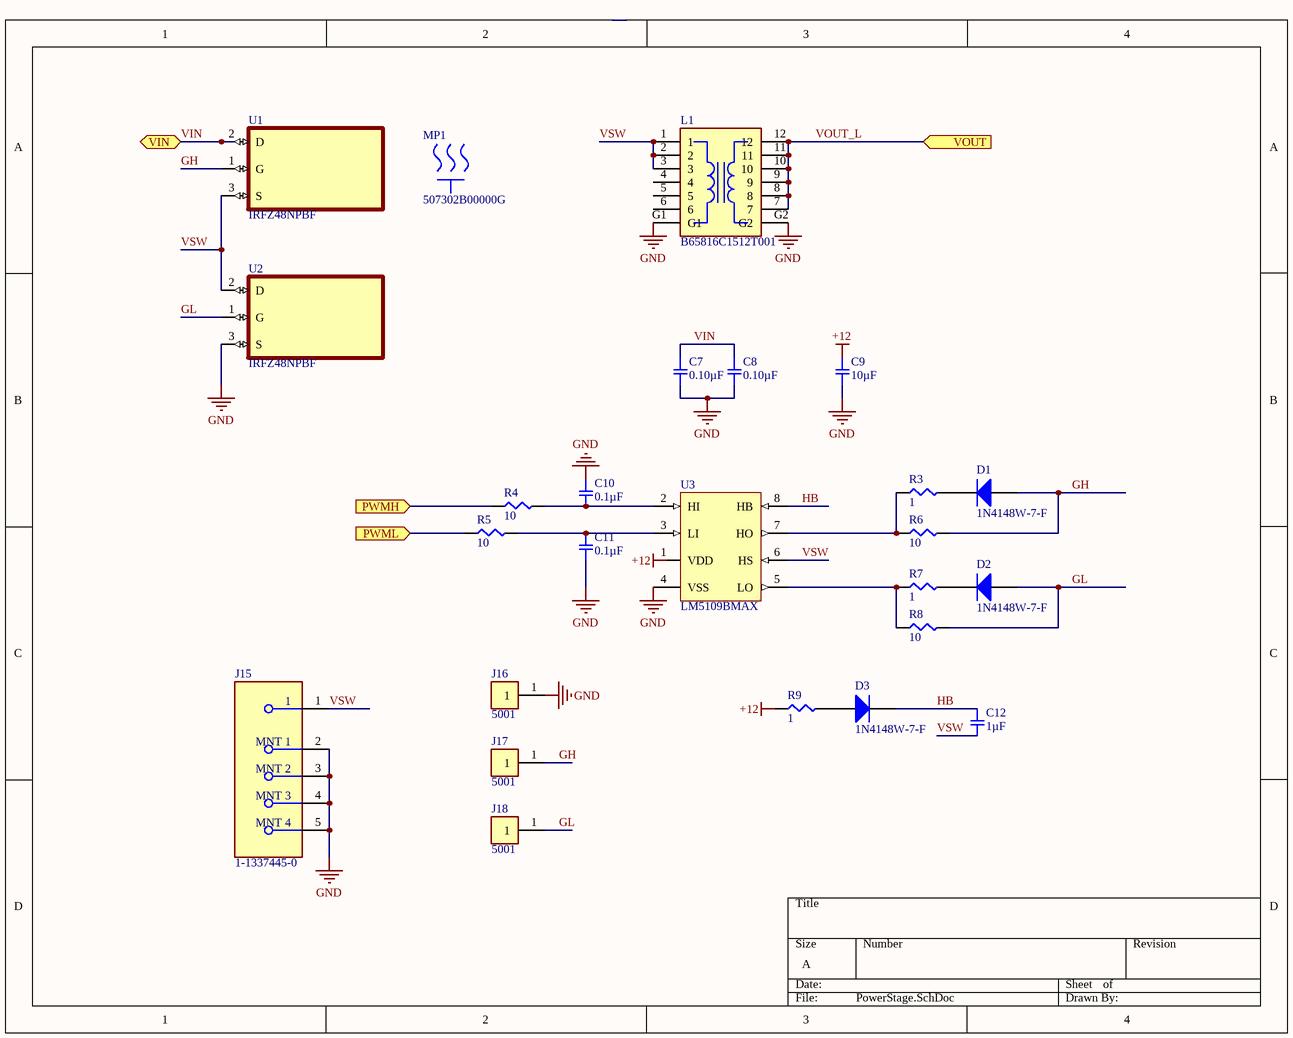
[diagram p4: PowerStage.SchDoc]

### Parts
C7  0.10µF  [SMD-0603-RES]
C8  0.10µF  [SMD-0603-RES]
C9  10µF  [SMD-0603-RES]
C10  0.1µF  [SMD-0603-RES]
C11  0.1µF  [SMD-0603-RES]
C12  1µF  [SMD-0603-RES]
D1  1N4148W-7-F  [DIOD-SOD123-2_V]
D2  1N4148W-7-F  [DIOD-SOD123-2_V]
D3  1N4148W-7-F  [DIOD-SOD123-2_V]
J15  1-1337445-0  [FP-1-1337445-0-MFG]
J16  5001  [FP-5001-MFG]
J17  5001  [FP-5001-MFG]
J18  5001  [FP-5001-MFG]
L1  B65816C1512T001  [B65816C1512T001]
MP1  507302B00000G  [FP-507302B00000G-MFG]
R3  1  [SMD-0603-RES]
R4  10  [SMD-0603-RES]
R5  10  [SMD-0603-RES]
R6  10  [SMD-0603-RES]
R7  1  [SMD-0603-RES]
R8  10  [SMD-0603-RES]
R9  1  [SMD-0603-RES]
U1  IRFZ48NPBF  [TO254P1041X444X1930-3]
U2  IRFZ48NPBF  [TO254P1041X444X1930-3]
U3  LM5109BMAX  [M08A_L]

### Ports
PWMH (in), PWML (in), VIN (bidir), VOUT (in)

### Nets
+12: C9.1 R9.1
VIN: C7.1 C7.2 C8.1 C8.2 C9.2 C10.1 C11.2 J15.2(MNT_1) J15.3(MNT_2) J15.4(MNT_3) J15.5(MNT_4) J16.1 L1.G1 L1.G2 U1.2(D) U2.3(S) U3.4(VSS) ; port VIN  [also labelled GND]
GH: D1.1(A) J17.1 R6.2 U1.1(G)
GL: D2.1(A) J18.1 R8.2 U2.1(G)
HB: C12.1 D3.2(K) U3.8(HB)
PWMH: R4.1 ; port PWMH
PWML: R5.1 ; port PWML
VOUT_L: L1.7 L1.8 L1.9 L1.10 L1.11 L1.12 ; port VOUT  [project net VOUT]
VSW: C12.2 J15.1 L1.1 L1.2 L1.3 U1.3(S) U2.2(D) U3.6(HS)
NetC10_2: C10.2 R4.2 U3.2(HI)
NetC11_1: C11.1 R5.2 U3.3(LI)
NetD1_2: D1.2(K) R3.2
NetD2_2: D2.2(K) R7.2
NetD3_1: D3.1(A) R9.2
NetR3_1: R3.1 R6.1 U3.7(HO)
NetR7_1: R7.1 R8.1 U3.5(LO)

Not connected (* = marked no-connect by the designer): L1 4 5 6; U3 1(VDD)

### Notes on the sheet
- Labels drawn without touching a wire or pin: +12

### Library data of the parts
C7 C8 = GRM188R71C104KA01D: CAP CER 0.1UF 16V X7R 0603; Manufacturer: Murata Electronics North America; Factory Stock: 0; Unit Price (USD): 0.1; Minimum Quantity: 1; Tolerance: ±10%; Part Number: GRM188R71C104KA01D; Datasheets: http://www.murata.com/~/media/webrenewal/support/library/catalog/products/capacitor/mlcc/c02e.pdf; Image: //media.digikey.com/Renders/Murata%20Renders/ZRB-SERIES-0402.jpg; Digi-Key Part Number: 490-1532-1-ND; Quantity Available: 4520200; @ qty: 0; Packaging: Cut Tape (CT); Series: GRM; Part Status: Active; Value: 0.10µF; Voltage: 16V; Temperature Coefficient: X7R; Operating Temperature: -55°C ~ 125°C; Features: -; Ratings: -; Applications: General Purpose; Mounting Type: Surface Mount, MLCC; Package / Case: 0603 (1608 Metric); Size / Dimension: 0.063" L x 0.031" W (1.60mm x 0.80mm); Height - Seated (Max): -; Thickness (Max): 0.035" (0.90mm); Lead Spacing: -; Lead Style: -
C9 = GRM188R61A106KE69D: as C17 on sheet Sensing; Part Number: GRM188R61A106KE69D; Datasheets: http://www.murata.com/~/media/webrenewal/support/library/catalog/products/capacitor/mlcc/c02e.pdf; Image: //media.digikey.com/Renders/Murata%20Renders/ZRB-SERIES-0402.jpg; Digi-Key Part Number: 490-10474-1-ND; Quantity Available: 59221; @ qty: 0; Packaging: Cut Tape (CT); Series: GRM; Part Status: Active; Value: 10µF; Voltage: 10V; Temperature Coefficient: X5R; Operating Temperature: -55°C ~ 85°C; Features: Derating Recommended; Ratings: -; Applications: General Purpose; Mounting Type: Surface Mount, MLCC; Package / Case: 0603 (1608 Metric); Size / Dimension: 0.063" L x 0.031" W (1.60mm x 0.80mm); Height - Seated (Max): -; Thickness (Max): 0.037" (0.95mm); Lead Spacing: -; Lead Style: -; ComponentLink1Description: New link; ComponentLink1URL: *
C10 C11 = GRM188R61C225KE15D: as C16 on sheet Sensing; Part Number: GRM188R61C225KE15D; Datasheets: http://www.murata.com/~/media/webrenewal/support/library/catalog/products/capacitor/mlcc/c02e.pdf; Image: //media.digikey.com/Renders/Murata%20Renders/ZRB-SERIES-0402.jpg; Digi-Key Part Number: 490-3296-1-ND; Quantity Available: 1668676; @ qty: 0; Packaging: Cut Tape (CT); Series: GRM; Part Status: Active; Value: 0.1µF; Voltage: 16V; Temperature Coefficient: X5R; Operating Temperature: -55°C ~ 85°C; Features: -; Ratings: -; Applications: General Purpose; Mounting Type: Surface Mount, MLCC; Package / Case: 0603 (1608 Metric); Size / Dimension: 0.063" L x 0.031" W (1.60mm x 0.80mm); Height - Seated (Max): -; Thickness (Max): 0.035" (0.90mm); Lead Spacing: -; Lead Style: -
C12 = GRM188R61E105KA12D: CAP CER 1UF 25V X5R 0603; Manufacturer: Murata Electronics North America; Factory Stock: 0; Unit Price (USD): 0.1; Minimum Quantity: 1; Tolerance: ±10%; Part Number: GRM188R61E105KA12D; Datasheets: http://www.murata.com/~/media/webrenewal/support/library/catalog/products/capacitor/mlcc/c02e.pdf; Image: //media.digikey.com/Renders/Murata%20Renders/ZRB-SERIES-0402.jpg; Digi-Key Part Number: 490-3897-1-ND; Quantity Available: 1883393; @ qty: 0; Packaging: Cut Tape (CT); Series: GRM; Part Status: Active; Value: 1µF; Voltage: 25V; Temperature Coefficient: X5R; Operating Temperature: -55°C ~ 85°C; Features: -; Ratings: -; Applications: General Purpose; Mounting Type: Surface Mount, MLCC; Package / Case: 0603 (1608 Metric); Size / Dimension: 0.063" L x 0.031" W (1.60mm x 0.80mm); Height - Seated (Max): -; Thickness (Max): 0.035" (0.90mm); Lead Spacing: -; Lead Style: -
D1-D3 = CMP-2000-04932-2: Fast Switching Diode, 100 V, 0.15 A, -65 to 150 degC, 2-Pin?SOD123, RoHS, Tape and Reel; Manufacturer: Diodes; Recovery Time: 4ns; Brand: DiodesIncorporated; Unit Weight: 0.000353oz; Max Surge Current: 2A; Peak Reverse Voltage: 100V; Ir - Reverse Current: 1uA; Vf - Forward Voltage: 1.25V; Configuration: Single; If - Forward Current: 0.15A; Product Category: Diodes-GeneralPurpose,Power,Switching; Operating Temperature Range: -65Cto+150C; Packaging: Reel; Manufacturer URL: http://www.diodes.com/; Maximum Operating Temperature: +150C; Height: 1.25mm; Minimum Operating Temperature: -65C; Product: SwitchingDiodes; Package URL: http://www.diodes.com/datasheets/ds18004.pdf; Type: SwitchingDiode; Package Reference: SOD123-2; Width: 1.7mm; Datasheet URL: http://www.farnell.com/datasheets/1915529.pdf; Datasheet Version: Rev. 24-2, 10/2013; Series: 1N4148; Factory Pack Quantity: 3000; Length: 2.85mm; RoHS: True; Manufacturer: DiodesIncorporated; Mounting Style: SMD/SMT; Package / Case: SOD-123; Manufacturer Part Number: 1N4148W-7-F
J15 = CMP-03357-000006-1: CONN BNC JACK STR 50 OHM PCB; Manufacturer: TE Connectivity; PCB Mount Retention: With; Operating Frequency: 0 to 4Hz; PCB Mounting Orientation: Vertical; PCB Thickness: 0.126inch; Body Plating: Silver; Frequency: 4GHz; Impedance: 50R; Insulation Resistance: 5GR; Body Material: Brass; Dielectric Material: PTFE; Gender: Female; Sealable: No (Without); Number of Positions: 1; Orientation: Straight; RoHS Compliant: Yes; Min Operating Temperature: -65°C; Packaging: Bag; Fastening Type: Bayonet; Radiation Hardening: No; Max Frequency: 4GHz; Material: Brass; Contact Plating: Silver; ELV: Compliant; Depth: 12mm; Series: BNC; Package Quantity: 50; Connector Type: BNC; Contact Material: Brass; Max Operating Temperature: 165°C; Length: 12mm; Termination: Solder; Mount: Through Hole; Insulation Material: Polytetrafluoroethylene; Manufacturer Part Number: 1-1337445-0
J16-J18 = CMP-2000-05181-2: as J4 on sheet TOPSHEET; Insulation Material: Nylon; Mount: Through Hole; RoHS Compliant: Yes; Series: THM; Height: 0.3inch; Termination: Through Hole; Material: Nylon; Packaging: Bulk; Contact Material: Bronze; REACH SVHC: No SVHC; Contact Plating: Silver; Orientation: Straight; Lead Free: Lead Free; Package Quantity: 100; Length: 7.62mm; Flammability Rating: UL94 V-0; Number of Contacts: 1; Diameter: 2.54mm; Housing Color: Black; Color: Black; Manufacturer Part Number: 5001
L1 = B65816C1512T001: BOBBIN COIL FORMER RM 12
MP1 = CMP-69313-000007-1: HEATSINK TO-220 2.5W LOW PROFILE; Manufacturer: Aavid Thermalloy; Thermal Resistance @ Forced Air Flow (100 LFM): 10°C/W; Natural Thermal Resistance: 24°C/W; Finish: Anodized; Shape: Square; Height Off Base: 0.38inch; Series: 5073; Package Cooled: TO-220; RoHS Compliant: Yes; Type: Passive; Color: Black; Length: 19.05mm; Package Quantity: 2000; Case/Package: TO-220; Mount: Bolt; Packaging: Bulk; Width: 19.05mm; Depth: 19.05mm; Material: Aluminium; Height: 9.65mm; Weight: 0.25lb; Lead Free: Lead Free; Radiation Hardening: No; REACH SVHC: No SVHC; Manufacturer Part Number: 507302B00000G
R3 R7 = ERJ-3EKF10R0V: RES SMD 10 OHM 1% 1/10W 0603; Manufacturer: Panasonic Electronic Components; Factory Stock: 0; Unit Price (USD): 0.00379; @ qty: 1500; Power (Watts): 0.1W, 1/10W; Temperature Coefficient: ±100ppm/°C; Part Number: ERJ-3EKF10R0V; Datasheets: http://industrial.panasonic.com/www-cgi/jvcr13pz.cgi?E+PZ+3+AOA0002+ERJ3EKF10R0V+7+WW; Image: //media.digikey.com/Photos/Panasonic%20Photos/MFG_ERJ-P6W%20Series.jpg; Digi-Key Part Number: P10.0HCT-ND; Quantity Available: 676435; Minimum Quantity: 1; Packaging: Cut Tape (CT); Series: ERJ; Part Status: Active; Value: 1; Tolerance: ±1%; Composition: Thick Film; Features: Automotive AEC-Q200; Operating Temperature: -55°C ~ 155°C; Package / Case: 0603 (1608 Metric); Supplier Device Package: 0603; Size / Dimension: 0.063" L x 0.031" W (1.60mm x 0.80mm); Height - Seated (Max): 0.022" (0.55mm); Number of Terminations: 2; Failure Rate: -
R4-R6 R8 = ERJ-3EKF10R0V: RES SMD 10 OHM 1% 1/10W 0603; Manufacturer: Panasonic Electronic Components; Factory Stock: 0; Unit Price (USD): 0.00379; @ qty: 1500; Minimum Quantity: 1; Power (Watts): 0.1W, 1/10W; Temperature Coefficient: ±100ppm/°C; Part Number: ERJ-3EKF10R0V; Datasheets: http://industrial.panasonic.com/www-cgi/jvcr13pz.cgi?E+PZ+3+AOA0002+ERJ3EKF10R0V+7+WW; Image: //media.digikey.com/Photos/Panasonic%20Photos/MFG_ERJ-P6W%20Series.jpg; Digi-Key Part Number: P10.0HCT-ND; Quantity Available: 676435; Packaging: Cut Tape (CT); Series: ERJ; Part Status: Active; Value: 10; Tolerance: ±1%; Composition: Thick Film; Features: Automotive AEC-Q200; Operating Temperature: -55°C ~ 155°C; Package / Case: 0603 (1608 Metric); Supplier Device Package: 0603; Size / Dimension: 0.063" L x 0.031" W (1.60mm x 0.80mm); Height - Seated (Max): 0.022" (0.55mm); Number of Terminations: 2; Failure Rate: -
R9 = ERJ-3BQF1R0V: RES SMD 1 OHM 1% 1/4W 0603; Manufacturer: Panasonic Electronic Components; Factory Stock: 0; Unit Price (USD): 0.05386; @ qty: 1500; Power (Watts): 0.25W, 1/4W; Temperature Coefficient: ±200ppm/°C; Part Number: ERJ-3BQF1R0V; Datasheets: https://industrial.panasonic.com/cdbs/www-data/pdf/RDA0000/AOA0000C239.pdf; Image: //media.digikey.com/Photos/Panasonic%20Photos/MFG_ERJ-P6W%20Series.jpg; Digi-Key Part Number: P17371CT-ND; Quantity Available: 30514; Minimum Quantity: 1; Packaging: Cut Tape (CT); Series: ERJ; Part Status: Active; Value: 1; Tolerance: ±1%; Composition: Thick Film; Features: Automotive AEC-Q200, Current Sense; Operating Temperature: -55°C ~ 125°C; Package / Case: 0603 (1608 Metric); Supplier Device Package: 0603; Size / Dimension: 0.063" L x 0.031" W (1.60mm x 0.80mm); Height - Seated (Max): 0.022" (0.55mm); Number of Terminations: 2; Failure Rate: -
U1 U2 = IRFZ48NPBF: MF: {'manufacturer': u'Infineon Technologies'}; Package: None; Price: None; Value: *; MP: IRFZ48NPBF; Availability: Unavailable
U3 = CMP-0063-00512-2: High Voltage 1A Peak Half Bridge Gate Driver, 8-pin Narrow SOIC; Manufacturer: National Semiconductor; Manufacturer: TI National Semiconductor; PowerWise: N; PackageTopMarking: NSZXTT*L5109*BMA; CompType: MiscPower; ComponentLink2URL: http://www.national.com/pf/LM/LM5109B.html; PackageReference: M08A; Code_IPC: SOIC127P600-8; ComponentLink1Description: LM5109B Datasheet; ComponentLink1URL: http://www.national.com/ds/LM/LM5109B.pdf; ComponentLink3Description: M08A Package Page; RoHS: N; ComponentLink3URL: http://www.national.com/packaging/folders/m08a.html; ComponentLink2Description: LM5109B Web Page; DatasheetVersion: Feb-2007; PinCount: 8; RevisionNote: Component URLs added; Code_JEDEC: MS-012-AA; PackageVersion: revM, May-2009; PackageDescription: SOIC Narrow, 4.9 x 3.9 x 1.45mm, 8 Lead, 1.27mm Pitch; Manufacturer Part Number: LM5109BMAX

## Nets that join several sheets
+3.3V: HotelRail (C31.1 DS2.1 U9.4), DigitalInterface (J19.2)
+5: HotelRail (7 pins), DigitalInterface (P1.1), Sensing (11 pins)
+12: HotelRail (J24.1 J24.2 J24.3 J24.4), Sensing (C18.1 U5.1 U5.3), PowerStage (C9.1 R9.1)
VIN: TOPSHEET (25 pins), HotelRail (9 pins), DigitalInterface (6 pins), Sensing (17 pins), PowerStage (17 pins)
IIN+: TOPSHEET (R1.1S), Sensing (R10.1)
IIN-: TOPSHEET (R1.2S), Sensing (R12.1)
IN+: TOPSHEET (R2.1S), Sensing (U8.2)
IN-: TOPSHEET (R2.2S), Sensing (U8.3)
IN_SENSE: DigitalInterface (R17.1), Sensing (U4.6 U4.7)
IOUT+: TOPSHEET (6 pins), Sensing (U6.2)
IOUT-: TOPSHEET (5 pins), Sensing (U6.3)
IOUT_SENSE: DigitalInterface (R18.1), Sensing (U4.1 U4.2)
PWMH: TOPSHEET (J4.1), DigitalInterface (J19.1), PowerStage (R4.1)
PWML: TOPSHEET (J13.1), DigitalInterface (J19.3), PowerStage (R5.1)
VIN_ADC: DigitalInterface (R15.1), Sensing (U6.7)
VOUT: TOPSHEET (C5.1 C6.1 J5.1 R2.1), PowerStage (6 pins)
VOUT_ADC: DigitalInterface (R16.1), Sensing (U8.7)